# EAGLE design untitled (EAGLE 9.6.2)
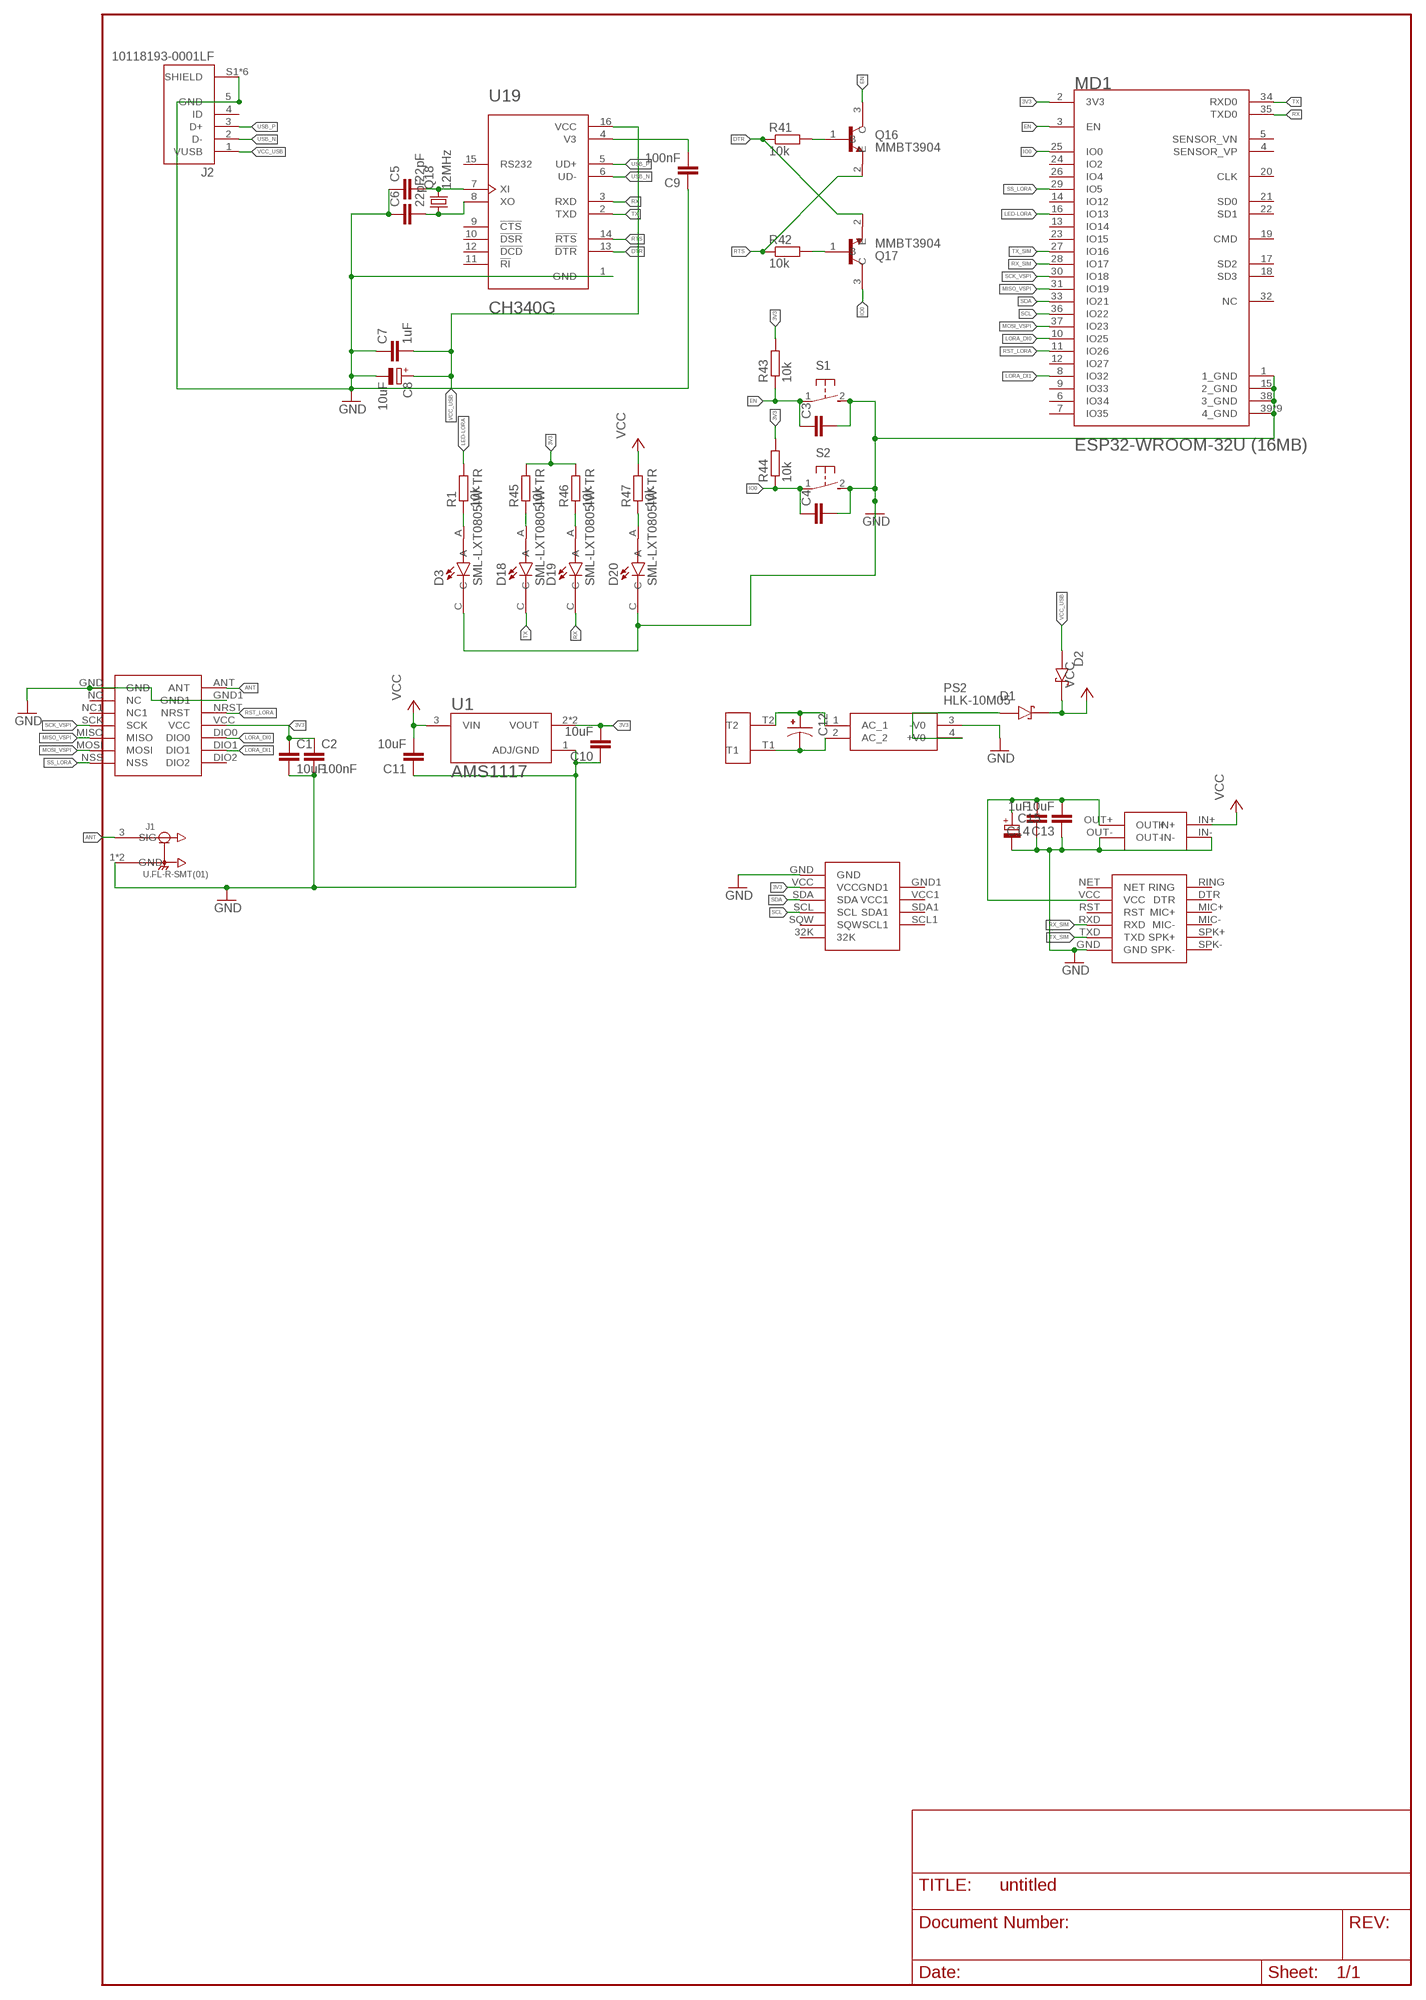
[diagram p0: schematic, sheet 1]

## Parts
C1  10uF  C-EUC0805K  [C0805K]
C2  100nF  C-EUC0805K  [C0805K]
C3  C-EUC0805K  [C0805K]
C4  C-EUC0805K  [C0805K]
C5  22pF  C-EUC0805K  [C0805K]
C6  22pF  C-EUC0805K  [C0805K]
C7  1uF  C-EUC0805K  [C0805K]
C8  10uF  CPOL-EU153CLV-0505  [153CLV-0505]
C9  100nF  C-EUC0805K  [C0805K]
C10  10uF  C-EUC0805K  [C0805K]
C11  10uF  C-EUC0805K  [C0805K]
C12  UPM2E100MHD1TO  [CAPPRD500W60D1250H2200]
C13  10uF  C-EUC0805K  [C0805K]
C14  1uF  C-EUC0805K  [C0805K]
C15  CPOL-EU153CLV-0505  [153CLV-0505]
D1  1N5819HW-7  [SOD3715X145N]
D2  1N5819HW-7  [SOD3715X145N]
D3  SML-LXT0805IW-TR  [LEDC2012X120N]
D18  SML-LXT0805IW-TR  [LEDC2012X120N]
D19  SML-LXT0805IW-TR  [LEDC2012X120N]
D20  SML-LXT0805IW-TR  [LEDC2012X120N]
J1  U.FL-R-SMT(01)  [HRS_U.FL-R-SMT(01)]
J2  10118193-0001LF  [FCI_10118193-0001LF]
LORA-NICERF-V1  LORA-NICERF-V2  [LORA-NICERF-V2]
MD1  ESPRESSIF_SYSTEMS_ESP32-WROOM-32U_16MBESPRESSIF_SYSTEMS_ESP32-WROOM-32U_16MB_0_0  [ESPRESSIF_SYSTEMS_ESP32-WROOM-32U_16MB_0]
MINI1  MINI360  [MINI360]
PS2  HLK-10M05  [HLK10M05]
Q16  MMBT3904  [SOT95P240X120-3N]
Q17  MMBT3904  [SOT95P240X120-3N]
Q18  12MHz  CRYSTALSM49  [SM49]
R1  10k  R-EU_R0805  [R0805]
R41  10k  R-EU_R0805  [R0805]
R42  10k  R-EU_R0805  [R0805]
R43  10k  R-EU_R0805  [R0805]
R44  10k  R-EU_R0805  [R0805]
R45  10k  R-EU_R0805  [R0805]
R46  10k  R-EU_R0805  [R0805]
R47  10k  R-EU_R0805  [R0805]
RTC1  RTC3231  [RTC3231]
S1  31-XX  [B3F-31XX]
S2  31-XX  [B3F-31XX]
SIM800L1  SIM800L  [SIM800L]
TB7.1  TB7.62  [TB7.62]
U1  AMS1117  [SOT229P700X180-4N]
U19  CH340G  [SOIC127P600X180-16N]

## Nets
3V3: C1.1 C2.1 C10.2 LORA-NICERF-V1.VCC MD1.2(3V3) R43.2 R44.2 R45.2 R46.2 RTC1.VCC U1.2(VOUT) U1.4(VOUT)
ANT: J1.3(SIG) LORA-NICERF-V1.ANT
DTR: Q17.2(E) R41.1 U19.13(!DTR)
EN: C3.1 MD1.3(EN) Q16.3(C) R43.1 S1.1(P)
GND: C1.2 C2.2 C3.2 C4.2 C5.1 C6.1 C7.1 C8.- C9.1 C10.1 C11.1 C13.1 C14.1 C15.- D3.C D20.C J1.1(GND) J1.2(GND) J2.5(GND) J2.S1(SHIELD) J2.S2(SHIELD) J2.S3(SHIELD) J2.S4(SHIELD) J2.S5(SHIELD) J2.S6(SHIELD) LORA-NICERF-V1.GND LORA-NICERF-V1.GND1 MD1.1(1_GND) MD1.15(2_GND) MD1.38(3_GND) MD1.39(4_GND) MD1.39-2(4_GND) MD1.39-3(4_GND) MD1.39-4(4_GND) MD1.39-5(4_GND) MD1.39-6(4_GND) MD1.39-7(4_GND) MD1.39-8(4_GND) MD1.39-9(4_GND) MINI1.IN- MINI1.OUT- PS2.3(-V0) RTC1.GND S1.2(S) S2.2(S) SIM800L1.GND U1.1(ADJ/GND) U19.1(GND)
IO0: C4.1 MD1.25(IO0) Q17.3(C) R44.1 S2.1(P)
LED-LORA: MD1.16(IO13) R1.2
LORA_DI0: LORA-NICERF-V1.DIO0 MD1.10(IO25)
LORA_DI1: LORA-NICERF-V1.DIO1 MD1.8(IO32)
MISO_VSPI: LORA-NICERF-V1.MISO MD1.31(IO19)
MOSI_VSPI: LORA-NICERF-V1.MOSI MD1.37(IO23)
N$1: C12.P PS2.1(AC_1) TB7.1.T2
N$2: C12.N PS2.2(AC_2) TB7.1.T1
N$3: D1.A PS2.4(+V0)
N$5: C13.2 C14.2 C15.+ MINI1.OUT+ SIM800L1.VCC
N$7: D3.A R1.1
N$11: Q17.1(B) R42.2
N$99: Q16.1(B) R41.2
N$102: C5.2 Q18.2 U19.7(XI)
N$103: C6.2 Q18.1 U19.8(XO)
N$104: C9.2 U19.4(V3)
N$105: D18.A R45.1
N$106: D19.A R46.1
N$107: D20.A R47.1
RST_LORA: LORA-NICERF-V1.NRST MD1.11(IO26)
RTS: Q16.2(E) R42.1 U19.14(!RTS)
RX: D19.C MD1.35(TXD0) U19.3(RXD)
RX_SIM: MD1.28(IO17) SIM800L1.RXD
SCK_VSPI: LORA-NICERF-V1.SCK MD1.30(IO18)
SCL: MD1.36(IO22) RTC1.SCL
SDA: MD1.33(IO21) RTC1.SDA
SS_LORA: LORA-NICERF-V1.NSS MD1.29(IO5)
TX: D18.C MD1.34(RXD0) U19.2(TXD)
TX_SIM: MD1.27(IO16) SIM800L1.TXD
USB_N: J2.2(D-) U19.6(UD-)
USB_P: J2.3(D+) U19.5(UD+)
VCC: C11.2 D1.C(K) D2.C(K) MINI1.IN+ R47.2 U1.3(VIN)
VCC_USB: C7.2 C8.+ D2.A J2.1(VUSB) U19.16(VCC)
Unconnected: J2.4(ID) LORA-NICERF-V1.DIO2 LORA-NICERF-V1.NC LORA-NICERF-V1.NC1 MD1.4(SENSOR_VP) MD1.5(SENSOR_VN) MD1.6(IO34) MD1.7(IO35) MD1.9(IO33) MD1.12(IO27) MD1.13(IO14) MD1.14(IO12) MD1.17(SD2) MD1.18(SD3) MD1.19(CMD) MD1.20(CLK) MD1.21(SD0) MD1.22(SD1) MD1.23(IO15) MD1.24(IO2) MD1.26(IO4) MD1.32(NC) RTC1.32K RTC1.GND1 RTC1.SCL1 RTC1.SDA1 RTC1.SQW RTC1.VCC1 SIM800L1.DTR SIM800L1.MIC+ SIM800L1.MIC- SIM800L1.NET SIM800L1.RING SIM800L1.RST SIM800L1.SPK+ SIM800L1.SPK- U19.9(!CTS) U19.10(!DSR) U19.11(!RI) U19.12(!DCD) U19.15(RS232)

## Library data of the parts
C1-C7 C9-C11 C13 C14 = rcl:C-EU: CAPACITOR, European symbol; SPICEPREFIX: C
C8 C15 = rcl:CPOL-EU: POLARIZED CAPACITOR, European symbol; SPICEPREFIX: C
C12 = UPM2E100MHD1TO:UPM2E100MHD1TO: CAP ALUM 10UF 20% 250V RADIAL Check availability <https://pricing.snapeda.com/parts/UPM2E100MHD1TO/Nichicon/view-part?ref=eda>; AVAILABILITY: In Stock; DESCRIPTION: 10 µF 250 V Aluminum Electrolytic Capacitors Radial, Can - 5000 Hrs @ 105°C; MF: Nichicon; MP: UPM2E100MHD1TO; PACKAGE: Radial Nichicon; PRICE: None; PURCHASE-URL: https://pricing.snapeda.com/search/part/UPM2E100MHD1TO/?ref=eda
D1 D2 = 1N5819HW-7:1N5819HW-7: 1N5819HW Series 40 V 1 A Surface Mount Schottky Barrier Rectifier - SOD-123 Check availability <https://pricing.snapeda.com/parts/1N5819HW-7/Diodes%20Inc./view-part?ref=eda>; AVAILABILITY: In Stock; DESCRIPTION: Diode Schottky 40 V 1A Surface Mount SOD-123; MF: Diodes Inc.; MP: 1N5819HW-7; PACKAGE: SOD-123 Fairchild Semiconductor; PRICE: None; PURCHASE-URL: https://pricing.snapeda.com/search/part/1N5819HW-7/?ref=eda
D3 D18-D20 = SML-LXT0805IW-TR:SML-LXT0805IW-TR: LED; Luminous Intensity:11µcd; Viewing Angle:140°; Forward Current:30mA; Forward Voltage:2V; Color:Red; LED Color:Red; Leaded Process Compatible:Yes; Lens Color:White; Mounting Type:Surface Mount ;RoHS Compliant: Yes Check availability <https://pricing.snapeda.com/parts/SML-LXT0805IW-TR/Lumex%20Opto/Components/view-part?ref=eda>; AVAILABILITY: In Stock; DESCRIPTION: Red - LED Indication - Discrete 2V 0805 (2012 Metric); MF: Lumex Opto/Components; MP: SML-LXT0805IW-TR; PACKAGE: 0805 Lumex; PRICE: None; PURCHASE-URL: https://pricing.snapeda.com/search/part/SML-LXT0805IW-TR/?ref=eda
J1 = U.FL-R-SMT_01_:U.FL-R-SMT(01): U.FL Series 6 Ghz 50 Ohm Ultra-small SMT Coaxial Cable Receptacle Check availability <https://pricing.snapeda.com/parts/U.FL-R-SMT%2801%29/Hirose/view-part?ref=eda>; AVAILABILITY: In Stock; DESCRIPTION: U.FL (UMCC) Connector Receptacle, Male Pin 50Ohm Surface Mount Solder. RF Connectors / Coaxial Connectors; MF: Hirose; MP: U.FL-R-SMT(01); PACKAGE: None; PRICE: None; PURCHASE-URL: https://pricing.snapeda.com/search/part/U.FL-R-SMT(01)/?ref=eda
J2 = 10118193-0001LF:10118193-0001LF: Micro USB B Type Receptacle Check availability <https://pricing.snapeda.com/parts/10118193-0001LF/FCI/view-part?ref=eda>; AVAILABILITY: In Stock; DESCRIPTION: USB - micro B USB 2.0 Receptacle Connector 5 Position Surface Mount, Right Angle; Through Hole; MF: FCI; MP: 10118193-0001LF; PACKAGE: None; PRICE: None; PURCHASE-URL: https://pricing.snapeda.com/search/part/10118193-0001LF/?ref=eda
LORA-NICERF-V1 = LORA-NICERF-V2:LORA-NICERF-V2
MD1 = Espressif Systems - ESP32-WROOM-32U (16MB):ESPRESSIF_SYSTEMS_ESP32-WROOM-32U_16MB: Bluetooth, WiFi 802.11b/g/n, Bluetooth v4.2 +EDR, Class 1, 2 and 3 Transceiver Module 2.4GHz ~ 2.5GHz Antenna Not Included, U.FL Surface Mount; AUTOMOTIVE: No; BANDWIDTH: 72MHz; CENTROID_NOT_SPECIFIED: No; DATASHEET: https://www.espressif.com/sites/default/files/documentation/esp32-wroom-32d_esp32-wroom-32u_datasheet_en.pdf; DATA_RATE: 150Mbits/s; DEVICE_CLASS_L1: Integrated Circuits (ICs); DEVICE_CLASS_L2: RF Semiconductors and Devices; DEVICE_CLASS_L3: Transceivers; DIGIKEY_DESCRIPTION: RX TXRX MODULE WIFI U.FL SMD; DIGIKEY_PART_NUMBER: 1904-1028-1-ND; FOOTPRINT_VARIANT_NAME_0: Recommended_Land_Pattern; HEIGHT: 3.35mm; INTERFACE: I2C,SPI,UART,Ethernet,I2S,Other; LEAD_FREE: Yes; MAX_FREQUENCY: 2484MHz; MAX_SUPPLY_VOLTAGE: 3.6V; MF: Espressif Systems; MFG_PACKAGE_IDENT: 0; MFG_PACKAGE_IDENT_DATE: 0; MFG_PACKAGE_IDENT_REV: 0; MIN_SUPPLY_VOLTAGE: 3V; MOUSER_PART_NUMBER: 356-ES32WROOM32U16MB; MPN: ESP32-WROOM-32U (16MB); NOMINAL_SUPPLY_CURRENT: 0.5A; NUMBER_OF_ADC_CHANNELS: 16; NUMBER_OF_GPIO: 26; PACKAGE: BT_MODULE; PREFIX: MD; ROHS: Yes; SENSITIVITY: -98dBm; TEMPERATURE_RANGE_HIGH: +85°C; TEMPERATURE_RANGE_LOW: -40°C; VERIFICATION_VERSION: 0.0.0.3
MINI1 = mini360:MINI360
PS2 = HLK-10M05:HLK-10M05: HI-LINK HLK-10M05 Manufacturer : HI-LINK <https://lcsc.com//brand-detail/11515.html> Mfr.Part # HLK-10M05 LCSC Part # C403745 <https://lcsc.com/product-detail/show_C403745.html> Package : Through Hole Datasheet :  EasyEDA Model <javascript:void(0);> Power Module AC-DC Through Hole RoHS Source: Datasheet <https://datasheet.lcsc.com/szlcsc/1909111105_HI-LINK-HLK-10M05_C403745.pdf> Check availability <https://pricing.snapeda.com/parts/HLK-10M05/Hi-link/view-part?ref=eda>; AVAILABILITY: Not in stock; DESCRIPTION: 10W Ultra-Compact Power Module; MF: Hi-link; MP: HLK-10M05; PACKAGE: Package; PRICE: None
Q16 Q17 = MMBT3904:MMBT3904: MMBT3904 Series 40 V CE Breakdown 0.2 A NPN General Purpose Amplifier - SOT-23 Check availability <https://pricing.snapeda.com/parts/MMBT3904/ON%20Semiconductor/view-part?ref=eda>; AVAILABILITY: In Stock; DESCRIPTION: Bipolar (BJT) Transistor NPN 40 V 200 mA 300MHz 300 mW Surface Mount SOT-23-3 (TO-236); MF: ON Semiconductor; MP: MMBT3904; PACKAGE: SOT-23-3 Motorola; PRICE: None
Q18 = crystal:CRYSTAL: CRYSTAL; OC_FARNELL: unknown; OC_NEWARK: unknown
R1 R41-R47 = rcl:R-EU_: RESISTOR, European symbol; SPICEPREFIX: R
RTC1 = rtc3231:RTC3231
S1 S2 = switch-omron:31-XX: OMRON SWITCH; MPN: B3F-3100; OC_FARNELL: 959704; OC_NEWARK: 36M3582
SIM800L1 = sim800l:SIM800L
TB7.1 = TB7.62:TB7.62
U1 = AMS1117:AMS1117: Sot223/Pkg 1-Amp 5-Volt Low Drop Out Voltage Regulatator Check availability <https://pricing.snapeda.com/parts/AMS1117/Advanced%20Monolithic%20Systems/view-part?ref=eda>; AVAILABILITY: Not in stock; DESCRIPTION: 1A LOW DROPOUT VOLTAGE REGULATOR SOT-223; MF: Advanced Monolithic Systems; MP: AMS1117; PACKAGE: SOT-223 Seeed Technology; PRICE: None
U19 = CH340G:CH340G: Check availability <https://pricing.snapeda.com/parts/Ch340G/WCH/view-part?ref=eda>; AVAILABILITY: Not in stock; DESCRIPTION: USB Interface Integrated Circuit; MF: WCH; MP: Ch340G; PACKAGE: None; PRICE: None

## Board
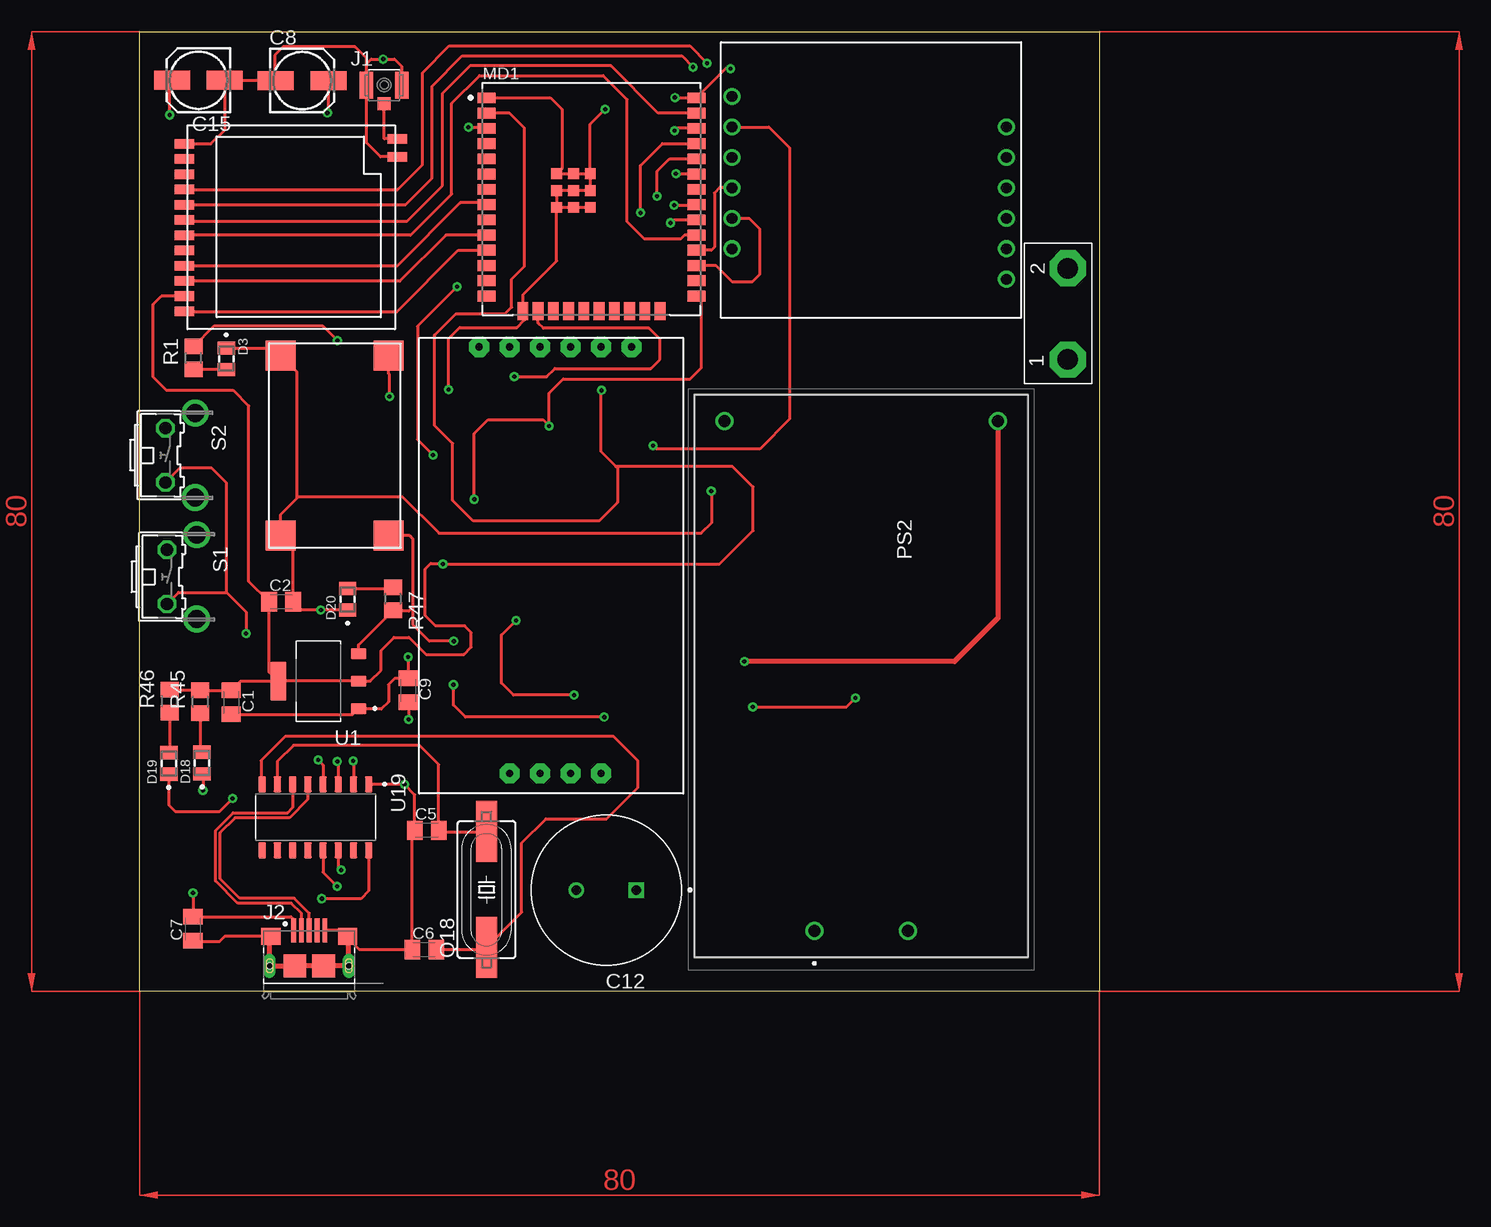
[diagram p1: board, top side]
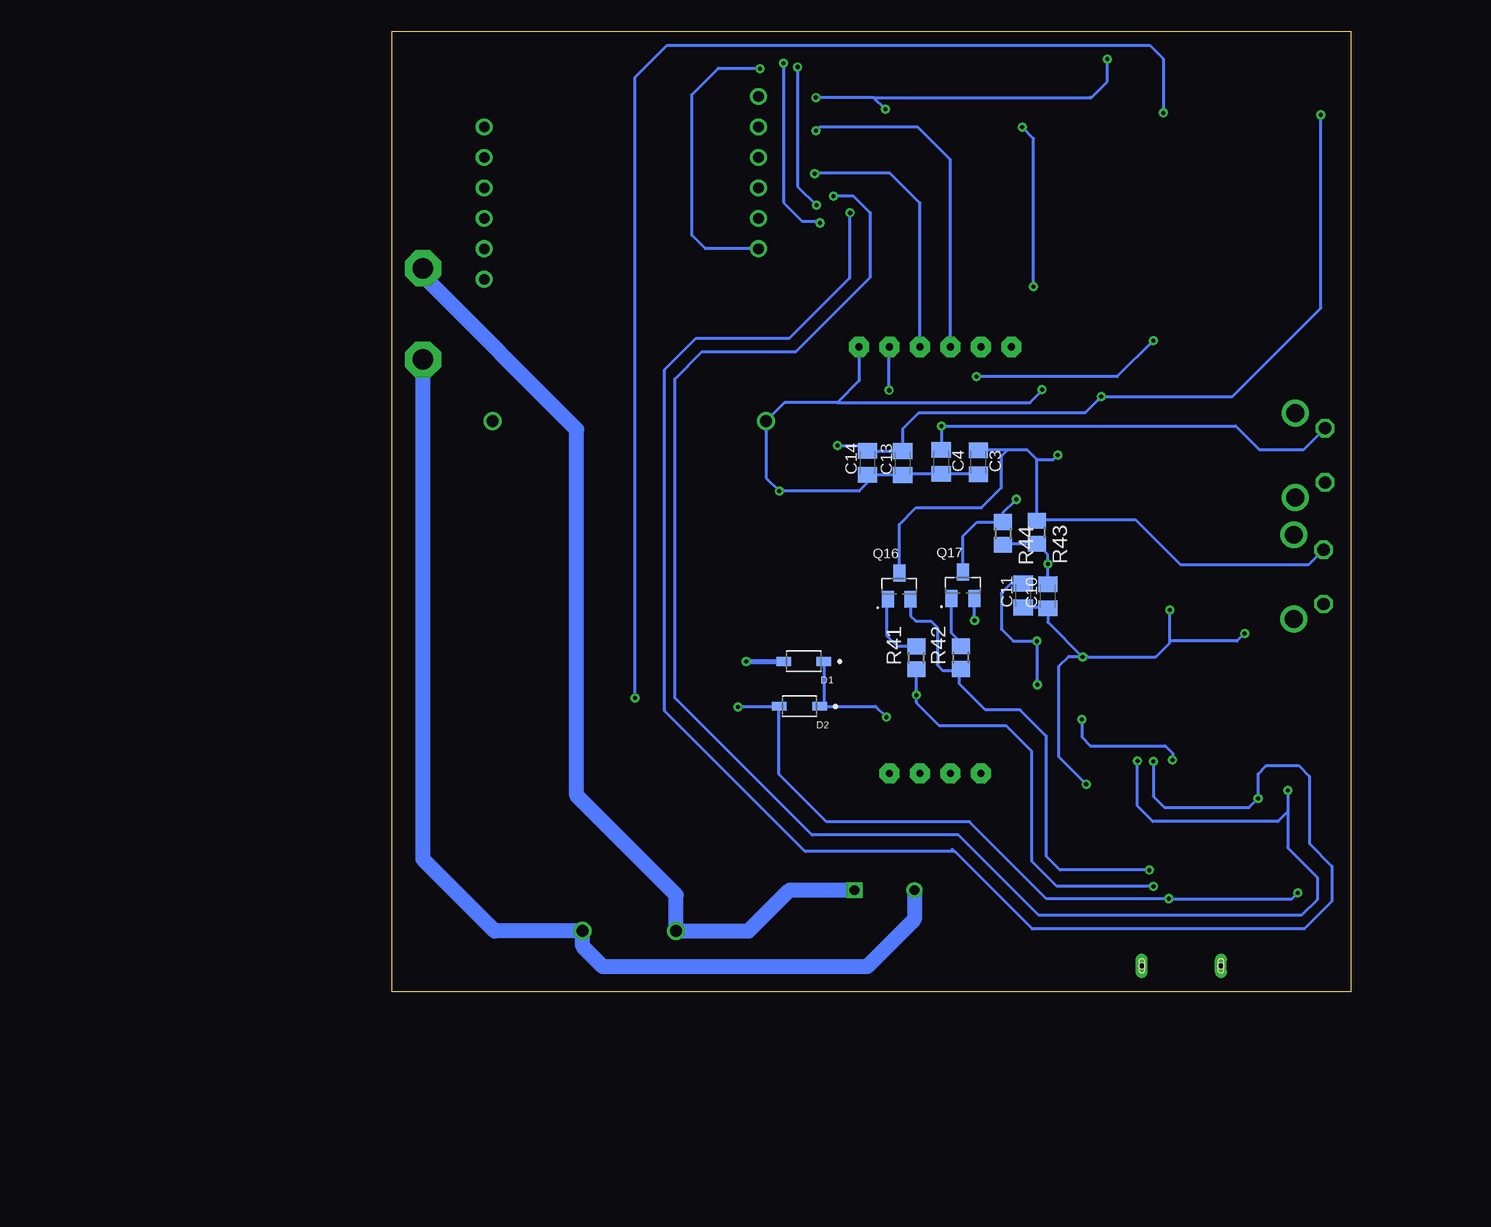
[diagram p2: board, bottom side, seen from below]

Size 80 x 80 mm. Coordinates in mm from the lower left corner, seen from the top.
Outline: 0,0 0,80 80,80 80,0 0,0
Copper layers (1*16): Top 0.035mm / dielectric 1.5mm / Bottom 0.035mm
Design rules "default": minimum track width 6mil, minimum drill 0.35mm, track to track 6mil, track to pad 6mil, pad to pad 6mil, via to via 6mil, smd to smd 6mil, copper to edge 40mil, drill to drill 6mil, minimum pad ring 10mil, minimum via ring 8mil, stop-mask expansion 4mil, vias tented up to drill 0mil, thermal gap 10mil

### Footprints (pad centres in the part's own frame; a part is rotated, then mirrored left to right if it is on the bottom)
C0805K = smd 1.3 x 1.6: 1 -1,0; 2 1,0
153CLV-0505 = smd 3 x 1.6: + 2.2,0; - -2.2,0
CAPPRD500W60D1250H2200 = drill 0.8 pad 1.15: N 2.5,0 | drill 0.8 pad 1.15 square: P -2.5,0
SOD3715X145N = smd 1.21 x 0.73: A 1.68,0; C -1.68,0
LEDC2012X120N = smd 1.1 x 1.45: A 0.9,0; C -0.9,0
HRS_U.FL-R-SMT(01) = smd 1.1 x 2.25: 1 -1.475,0; 2 1.475,0 | smd 1.05 x 1.1: 3 0,-1.55
FCI_10118193-0001LF = smd 0.4 x 2: 1 -1.3,2.975; 2 -0.65,2.975; 3 0,2.975; 4 0.65,2.975; 5 1.3,2.975 | smd 1.6 x 1.4: S1 -3.2,2.45; S2 3.2,2.45 | smd 1.9 x 1.9: S3 1.2,0; S4 -1.2,0 | drill 0.5 pad 0.9 long: S5 -3.3,0; S6 3.3,0 | hole 0.5: -3.3,0; 3.3,0
LORA-NICERF-V2 = smd 1.6 x 0.8: ANT 9.17,6.81; DIO0 -8.57,-5.03; DIO1 -8.57,-3.76; DIO2 -8.57,-2.49; GND -8.57,6.4; GND1 9.17,5.31; MISO -8.57,1.32; MOSI -8.57,0.05; NC -8.57,5.13; NC1 -8.57,3.86; NRST -8.57,-7.57; NSS -8.57,-1.22; SCK -8.57,2.59; VCC -8.57,-6.3
ESPRESSIF_SYSTEMS_ESP32-WROOM-32U_16MB_0 = smd 1.5 x 0.9: 1 -8.75,8.41; 2 -8.75,7.14; 3 -8.75,5.87; 4 -8.75,4.6; 5 -8.75,3.33; 6 -8.75,2.06; 7 -8.75,0.79; 8 -8.75,-0.48; 9 -8.75,-1.75; 10 -8.75,-3.02; 11 -8.75,-4.29; 12 -8.75,-5.56; 13 -8.75,-6.83; 14 -8.75,-8.1; 25 8.75,-8.1; 26 8.75,-6.83; 27 8.75,-5.56; 28 8.75,-4.29; 29 8.75,-3.02; 30 8.75,-1.75; 31 8.75,-0.48; 32 8.75,0.79; 33 8.75,2.06; 34 8.75,3.33; 35 8.75,4.6; 36 8.75,5.87; 37 8.75,7.14; 38 8.75,8.41 | smd 0.9 x 1.5: 15 -5.71,-9.35; 16 -4.44,-9.35; 17 -3.17,-9.35; 18 -1.9,-9.35; 19 -0.63,-9.35; 20 0.64,-9.35; 21 1.91,-9.35; 22 3.18,-9.35; 23 4.45,-9.35; 24 5.72,-9.35 | smd 0.9 x 0.9: 39 -2.9,2.09; 39-2 -1.5,0.69; 39-3 -1.5,2.09; 39-4 -0.1,2.09; 39-5 -0.1,-0.71; 39-6 -1.5,-0.71; 39-7 -2.9,-0.71; 39-8 -0.1,0.69; 39-9 -2.9,0.69
MINI360 = smd 2.5 x 2.5: IN+ 1,1; IN- 1,10; OUT+ 16,1; OUT- 16,10
HLK10M05 = drill 1 pad 1.5: 1 0,0; 2 0,-7.8; 3 42.5,7.5; 4 42.5,-15.3
SOT95P240X120-3N = smd 1 x 1.4: 1 -0.95,-1.1; 2 0.95,-1.1; 3 0,1.1
SM49 = smd 5.08 x 1.778: 1 -4.826,0; 2 4.826,0
R0805 = smd 1.3 x 1.5: 1 -0.95,0; 2 0.95,0
RTC3231 = drill 0.6 pad 1.676 octagon: 32K -15.24,0; GND -15.24,12.7; GND1 20.32,10.16; SCL -15.24,5.08; SCL1 20.32,2.54; SDA -15.24,7.62; SDA1 20.32,5.08; SQW -15.24,2.54; VCC -15.24,10.16; VCC1 20.32,7.62
B3F-31XX = drill 1.016 octagon: 1 -2.261,-1.245; 2 2.261,-1.245 | drill 1.499 pad 2.159: 3 -3.505,1.245; 4 3.505,1.245
SIM800L = drill 0.9: DTR 17.78,-7.62; GND -5.08,-15.24; MIC+ 17.78,-10.16; MIC- 17.78,-12.7; NET -5.08,-2.54; RING 17.78,-5.08; RST -5.08,-7.62; RXD -5.08,-10.16; SPK+ 17.78,-15.24; SPK- 17.78,-17.78; TXD -5.08,-12.7; VCC -5.08,-5.08
TB7.62 = drill 1.7 pad 3 octagon: T1 -3.7,-0.6; T2 3.9,-0.6
SOT229P700X180-4N = smd 1.31 x 0.93: 1 -3.345,2.29; 2 -3.345,0; 3 -3.345,-2.29 | smd 1.31 x 3.24: 4 3.345,0
SOIC127P600X180-16N = smd 1.31 x 0.62: 1 -2.75,4.445; 2 -2.75,3.175; 3 -2.75,1.905; 4 -2.75,0.635; 5 -2.75,-0.635; 6 -2.75,-1.905; 7 -2.75,-3.175; 8 -2.75,-4.445; 9 2.75,-4.445; 10 2.75,-3.175; 11 2.75,-1.905; 12 2.75,-0.635; 13 2.75,0.635; 14 2.75,1.905; 15 2.75,3.175; 16 2.75,4.445

### Placement (x,y rotation side)
C1  7.65,24.07 270 top
C2  11.81,32.47 0 top
C3  31.07,44.09 270 bottom
C4  34.17,44.12 270 bottom
C5  23.95,13.41 0 top
C6  23.73,3.46 0 top
C7  4.45,5.2 90 top
C8  13.56,75.91 0 top
C9  22.42,25.08 270 top
C10  25.28,32.92 90 bottom
C11  27.34,32.98 90 bottom
C12  38.9,8.43 180 top
C13  37.38,44.02 90 bottom
C14  40.31,44.06 90 bottom
C15  4.91,75.94 180 top
D1  45.64,27.49 180 bottom
D2  45.98,23.75 180 bottom
D3  7.23,52.72 270 top
D18  5.22,19.01 90 top
D19  2.44,18.99 90 top
D20  17.35,32.66 90 top
J1  20.39,75.53 0 top
J2  14.15,2.11 0 top
LORA-NICERF-V1  12.32,64.24 0 top
MD1  37.67,66.05 0 top
MINI1  21.78,36.96 90 top
PS2  56.26,5.02 90 top
Q16  37.67,33.77 0 bottom
Q17  32.35,33.84 0 bottom
Q18  28.93,8.47 90 top
R1  4.5,52.79 90 top
R41  36.23,27.79 90 bottom
R42  32.53,27.81 90 bottom
R43  26.2,38.25 270 bottom
R44  29.02,38.16 270 bottom
R45  5.07,24.13 90 top
R46  2.51,24.17 90 top
R47  21.13,32.71 270 top
RTC1  28.32,38.47 270 top
S1  3.54,34.54 270 top
S2  3.41,44.67 270 top
SIM800L1  54.48,77.13 0 top
TB7.1  76.78,56.36 90 top
U1  14.91,25.85 180 top
U19  14.67,14.5 270 top

### Tracks (layer width: path | path; a pad name or v marks a point on that pad's centre or on a via)
3V3  (via drill 0.35)
  Top 0.254: R46.2 5.04,25.12 R45.2 7.63,25.09 C1.1 8.42,25.85 U1.4 | U1.4 U1.2 19.23,25.85 20.13,26.75 20.13,28.4 21.22,29.49 22.45,29.49 23.87,28.07 27.04,28.07 27.66,28.69 27.66,29.9 27.1,30.45 24.68,30.45 23.81,31.32 23.81,35.18 24.29,35.66 25.27,35.66 25.31,35.62 v25.28,35.62 48.37,35.62 51.15,38.4 51.15,42.03 49.45,43.73 39.85,43.73 | U1.4 10.81,26.61 C2.1 9.11,34.16 9.11,48.78 7.8,50.1 2.23,50.1 1.14,51.18 1.14,57.27 1.81,57.94 LORA-NICERF-V1.VCC | 39.85,43.73 39.72,43.73 38.48,44.98 38.48,50.06 v38.51,50.1 | 39.85,43.73 39.85,40.75 38.31,39.21 27.82,39.21 26.11,40.92 26.11,45.65 24.6,47.17 24.6,54.71 26.38,56.48 30.48,56.48 31.02,57.02 31.02,59.37 32.08,60.42 32.08,71.95 30.83,73.19 MD1.2
  Bottom 0.254: R44.2 28.92,37.3 R43.2 25.28,36.39 v25.28,35.62 C10.2 25.36,33.85 | v38.51,50.1 38.51,53.68 RTC1.VCC
ANT
  Top 0.254: LORA-NICERF-V1.ANT 20.39,71.05 J1.3
DTR  (via drill 0.35)
  Top 0.254: U19.13 15.3,9.91 v16.47,8.74 | v36.23,24.68 31.17,24.68 30.17,25.68 30.17,29.7 v31.38,30.91
  Bottom 0.254: v16.47,8.74 24.55,8.74 26.63,10.83 26.63,20 28.75,22.13 34.32,22.13 36.23,24.04 v36.23,24.68 R41.1 | v31.38,30.91 31.38,32.72 Q17.2
EN  (via drill 0.35)
  Top 0.254: v24.46,44.7 23.16,45.99 23.16,55.43 v26.47,58.74 | v27.42,72.03 28.81,72.03 MD1.3
  Bottom 0.254: R43.1 26.2,39.28 | 26.2,39.28 26.2,44.31 | 28.64,45.09 26.98,45.09 26.2,44.31 | 28.64,45.09 C3.1 | Q16.3 37.67,38.91 36.27,40.3 30.8,40.3 29.14,41.97 29.14,44.6 28.64,45.09 | S1.1 3.55,35.55 14.21,35.55 17.95,39.28 26.2,39.28 | 26.2,44.31 24.85,44.31 v24.46,44.7 | v26.47,58.74 26.47,71.09 v27.42,72.03
GND  (via drill 0.35)
  Top 0.254: 28.89,74.49 MD1.1 34.27,74.46 35.21,73.52 35.21,68.58 MD1.39 MD1.39-3 MD1.39-4 | MD1.39-4 MD1.39-8 MD1.39-2 MD1.39-9 MD1.39-7 | MD1.39-7 MD1.39-6 MD1.39-5 | J2.S2 16.82,5.09 J2.5 | U19.1 v22.08,17.25 22.95,16.38 C5.1 22.73,13.19 C6.1 18.35,3.46 17.45,4.36 | J2.S1 7.08,4.56 6.65,4.13 4.52,4.13 C7.1 | C1.2 17.77,23.07 U1.1 18.3,23.52 20.14,23.52 20.76,24.13 20.76,25.56 21.28,26.08 C9.1 22.38,26.11 v22.38,27.86 | D20.C v15.11,31.76 13.51,31.76 C2.2 12.81,37.34 12.18,37.97 MINI1.IN- 11.78,39.75 13.1,41.07 | S1.2 3.25,33.24 7.25,33.24 | 7.25,33.24 8.87,31.62 v8.87,29.82 | 7.25,33.24 7.25,42.37 6.03,43.59 3.35,43.59 S2.2 | 13.1,41.07 13.27,41.23 21.91,41.23 24.96,38.18 46.82,38.18 47.66,39.02 v47.66,41.69 | 13.1,41.07 13.1,51.64 MINI1.OUT- 11.12,53.62 D3.C | v25.76,50.14 25.76,54.4 26.69,55.33 31.47,55.33 32.07,55.93 32.07,56.97 31.96,57.07 MD1.15 31.96,58.06 34.77,60.87 MD1.39-7 | MD1.39-4 37.57,72.27 v38.82,73.52 | v44.62,74.5 46.38,74.5 MD1.38 48.87,76.91 v49.26,76.91 | 3.73,70.65 LORA-NICERF-V1.GND 5.93,70.64 7.13,71.84 7.13,75.92 C15.- 11.28,75.94 | 11.28,75.94 11.33,75.94 C8.- | LORA-NICERF-V1.GND1 20.09,69.55 18.92,70.72 J1.1 | 11.28,75.94 11.28,78.01 11.99,78.72 17.96,78.72 18.92,77.76 J1.1 | J1.2 21.87,77.09 21.25,77.71 v20.32,77.71 19.32,77.71 18.92,77.31 J1.1
  Top 0.406: J2.S2 17.45,4.36 J2.S6 J2.S3 J2.S4 J2.S5 10.85,4.46 J2.S1
  Bottom 0.254: C3.2 34.14,43.09 C4.2 37.28,43.12 C13.1 40.28,43.02 | 40.28,43.02 C14.1 | RTC1.GND 41.02,50.88 42.84,49.06 | 25.25,31.96 C10.1 | C10.1 25.34,31.98 C11.1 | C10.1 25.28,30.76 v22.38,27.86 21.96,27.86 | 21.96,27.86 16.29,27.86 15.11,29.04 15.11,29.18 | 15.11,29.18 v15.11,31.76 | v22.08,17.25 24.35,19.51 24.35,27.1 23.55,27.9 22,27.9 21.96,27.86 | v8.87,29.82 9.51,29.18 15.11,29.18 | 42.84,49.06 26.76,49.06 25.76,50.06 v25.76,50.14 | v38.82,73.52 39.8,74.5 | 39.8,74.5 v44.62,74.5 | 40.28,43.02 40.28,42.43 41.02,41.69 v47.66,41.69 48.76,42.79 PS2.3 47.22,49.06 42.84,49.06 | 39.8,74.5 21.65,74.5 20.32,75.83 20.32,77.73 20.32,77.74 v20.32,77.71 | SIM800L1.GND 53.82,61.89 54.96,63.02 54.96,74.74 52.75,76.94 49.26,76.94 v49.26,76.91
IO0  (via drill 0.35)
  Top 0.254: v27.91,41 27.91,46.48 29.06,47.63 33.63,47.63 v34.15,47.12 34.15,49.85 35.32,51.03 45.9,51.03 46.84,51.97 46.84,57.53 MD1.25
  Bottom 0.254: C4.1 34.16,47.1 v34.15,47.12 9.62,47.12 7.64,45.14 3.96,45.14 S2.1 | Q17.3 32.35,37.94 31.19,39.11 R44.1 29.02,39.9 v27.91,41
LED-LORA  (via drill 0.35)
  Top 0.254: R1.2 6.23,55.48 15.26,55.48 v16.5,54.24 | v31.24,51.22 33.93,51.22 34.62,51.91 42.63,51.91 43.38,52.66 43.38,54.35 42.47,55.26 33.67,55.26 33.23,55.7 MD1.16
  Bottom 0.254: v16.5,54.24 19.51,51.22 v31.24,51.22
LORA_DI0
  Top 0.254: MD1.10 25.55,63.03 21.7,59.18 3.78,59.18 LORA-NICERF-V1.DIO0
LORA_DI1
  Top 0.254: MD1.8 28.77,65.72 26.73,65.72 21.48,60.46 3.77,60.46 LORA-NICERF-V1.DIO1
MISO_VSPI  (via drill 0.35)
  Top 0.254: LORA-NICERF-V1.MISO 22.16,65.56 24.37,67.77 24.37,75.43 26.91,77.97 45.21,77.97 v46.13,77.04 | 46.5,65.5 46.46,65.53 | 46.46,65.53 MD1.31 | v44.58,65.53 46.46,65.53
  Bottom 0.254: v46.13,77.04 46.13,67.08 v44.58,65.53
MOSI_VSPI
  Top 0.254: LORA-NICERF-V1.MOSI 3.87,64.17 22.27,64.17 25.26,67.16 25.26,74.85 27.54,77.13 39.29,77.13 43.23,73.19 MD1.37
N$1
  Bottom 1.27: C12.P 46.82,8.43 50.23,5.02 PS2.1 56.26,8.02 64.55,16.31 64.55,46.83 77.38,59.65 TB7.1.T2
N$2
  Bottom 1.27: C12.N 36.4,5.99 40.34,2.05 62.37,2.05 64.06,3.74 PS2.2 71.4,5.02 77.38,11 TB7.1.T1
N$3  (via drill 0.35)
  Top 0.406: PS2.4 71.56,31.1 67.94,27.47 v50.42,27.47
  Bottom 0.406: v50.42,27.47 47.33,27.47 D1.A
N$5  (via drill 0.35)
  Top 0.254: v20.83,49.56 20.83,51.41 20.78,51.46 MINI1.OUT+ | v2.52,73.05 2.52,75.74 C15.+ | SIM800L1.VCC 52.47,72.05 54.18,70.34 54.18,47.68 51.7,45.2 43.09,45.2 v42.81,45.48
  Bottom 0.254: v2.52,73.05 2.52,56.96 9.92,49.56 v20.83,49.56 22.16,48.22 36.04,48.22 37.38,46.89 C13.2 40.28,45.02 C14.2 40.73,45.48 v42.81,45.48
N$7
  Top 0.254: 7.46,51.59 D3.A 7.21,51.84 R1.1
N$11
  Bottom 0.254: R42.2 32.53,29.07 33.3,29.85 Q17.1
N$99
  Bottom 0.254: R41.2 37.79,28.74 38.68,29.63 38.68,32.61 Q16.1
N$102
  Top 0.254: 25.07,13.06 25,13.26 | 25,13.26 C5.2 24.95,18.9 23.35,20.5 12.83,20.5 11.49,19.16 U19.7 | Q18.2 28.89,13.26 25,13.26
N$103
  Top 0.254: C6.2 28.74,3.46 Q18.1 31.87,6.58 31.87,12.37 33.87,14.38 38.95,14.38 41.55,16.98 41.55,19.2 39.5,21.25 12.15,21.25 10.13,19.23 10.13,17.34 U19.8
N$104  (via drill 0.35)
  Top 0.254: C9.2 22.42,22.68 v22.43,22.66 | v14.89,19.27 15.3,18.85 U19.4
  Bottom 0.254: v22.43,22.66 22.43,21.18 21.71,20.46 15.51,20.46 14.85,19.8 14.85,19.31 v14.89,19.27
N$105
  Top 0.254: R45.1 5.07,20.06 D18.A
N$106
  Top 0.254: R46.1 2.51,19.96 D19.A
N$107
  Top 0.254: D20.A 21.03,33.56 R47.1
RST_LORA
  Top 0.254: MD1.11 26.57,61.76 21.47,56.67 LORA-NICERF-V1.NRST
RTS  (via drill 0.35)
  Top 0.254: U19.14 16.57,10.33 v16.81,10.09
  Bottom 0.254: Q16.2 36.72,31.28 36.28,30.84 35.02,30.84 34.5,30.32 34.5,27.2 34.05,26.75 32.64,26.75 | v16.81,10.09 24.27,10.09 25.39,11.21 25.39,21.25 27.59,23.45 30.49,23.45 32.64,25.6 32.64,26.75 | 32.64,26.75 R42.1
RX  (via drill 0.35)
  Top 0.254: D19.C 2.44,15.51 2.96,14.99 6.68,14.99 v7.75,16.06 | v16.49,19.14 16.57,19.06 U19.3 | v41.76,64.88 41.76,68.84 43.58,70.65 MD1.35
  Bottom 0.254: v16.49,19.14 16.49,16.25 15.55,15.3 8.51,15.3 v7.75,16.06 7.75,18.12 7.07,18.8 4.37,18.8 3.48,17.91 3.48,12.3 1.6,10.41 1.6,7.5 3.91,5.19 26.59,5.19 33.05,11.65 | 33.05,11.65 33.23,11.84 | 33.05,11.65 45.51,11.65 57.22,23.35 57.22,51.81 54.6,54.43 46.83,54.43 41.82,59.43 41.82,64.83 v41.76,64.88
RX_SIM
  Top 0.254: SIM800L1.RXD 48.37,66.97 47.93,66.53 47.93,62.03 47.67,61.76 MD1.28
SCK_VSPI  (via drill 0.35)
  Top 0.254: LORA-NICERF-V1.SCK 21.51,66.83 23.58,68.9 23.58,76.56 25.83,78.81 45.88,78.81 v47.32,77.36 | 46.45,64.27 MD1.30 44.54,64.3 v44.28,64.05
  Bottom 0.254: v47.32,77.36 47.32,65.74 45.76,64.19 44.42,64.19 v44.28,64.05
SCL  (via drill 0.35)
  Top 0.254: MD1.36 44.78,71.92 v44.6,71.75
  Bottom 0.254: RTC1.SCL 33.4,69.3 36.13,72.03 44.31,72.03 v44.6,71.75
SDA  (via drill 0.35)
  Top 0.254: MD1.33 44.75,68.11 v44.71,68.15
  Bottom 0.254: RTC1.SDA 35.94,65.7 38.42,68.19 44.67,68.19 v44.71,68.15
SS_LORA
  Top 0.254: MD1.29 45.43,63.03 45.11,62.71 42.09,62.71 40.66,64.14 40.66,74.34 38.66,76.33 28.34,76.33 26.02,74.02 26.02,66.45 22.59,63.02 LORA-NICERF-V1.NSS
TX  (via drill 0.35)
  Top 0.254: D18.C 5.3,18.03 5.3,16.76 v5.29,16.74 | v17.8,19.19 17.84,19.15 U19.2 | 46.53,69.5 MD1.34 44.19,69.38 43.14,68.34 v43.14,66.27
  Bottom 0.254: v17.8,19.19 17.83,19.16 17.83,15.45 16.53,14.15 6.11,14.15 5.29,14.97 v5.29,16.74 5.29,11.95 2.84,9.5 2.84,7.61 4.13,6.32 26.03,6.32 32.72,13.01 44.94,13.01 56.38,24.44 56.38,51.04 54.11,53.3 46.28,53.3 40.06,59.53 40.06,64.86 41.49,66.29 43.14,66.29 v43.14,66.27
TX_SIM
  Top 0.254: SIM800L1.TXD 50.82,64.43 51.67,63.58 51.67,59.73 51.08,59.12 49.42,59.12 48.05,60.49 47.14,60.49 47.12,60.47 46.44,60.47 MD1.27
USB_N
  Top 0.254: J2.2 13.5,6.49 12.66,7.33 8.19,7.33 6.33,9.19 6.33,13.4 7.8,14.87 12.33,14.87 12.76,15.3 U19.6
USB_P
  Top 0.254: J2.3 14.15,6.49 12.9,7.74 8.35,7.74 6.74,9.35 6.74,13.23 7.97,14.46 12.5,14.46 14.03,16 U19.5
VCC  (via drill 0.35)
  Top 0.254: MINI1.IN+ 22.5,37.97 22.8,37.67 22.8,32.03 | U1.3 18.25,28.86 21.13,31.73 R47.2 21.2,31.69 22.45,31.69 22.8,32.03 | 22.8,32.03 22.82,32.05 22.82,30.51 24.15,29.18 v26.2,29.18 | v38.74,22.85 27.16,22.85 26.16,23.85 v26.16,25.55
  Bottom 0.254: D1.C 43.96,24.09 D2.C 39.64,23.75 v38.74,22.85 | C11.2 28.37,33.98 29.17,33.18 29.17,30.17 28.17,29.18 26.3,29.18 | 26.3,29.18 v26.2,29.18 | v26.16,25.55 26.16,29.04 26.3,29.18
VCC_USB  (via drill 0.35)
  Top 0.254: J2.1 12.88,5.12 12.88,5.93 12.62,6.2 C7.2 v4.45,8.2 | U19.16 19.11,8.36 18.47,7.71 v15.2,7.71 | v51.12,23.69 58.95,23.69 v59.69,24.44 | v15.66,73.22 15.76,73.32 C8.+
  Bottom 0.254: v4.45,8.2 4.94,7.71 v15.2,7.71 25.39,7.71 31.8,14.12 43.73,14.12 47.69,18.07 47.69,23.72 D2.A 47.72,23.69 v51.12,23.69 | v59.69,24.44 59.69,76.18 57.02,78.86 16.79,78.86 15.66,77.73 v15.66,73.22
(copper drawn outside any net)
  shapes: Top area x3